# EAGLE design rp-schield-vias (EAGLE 9.0.1)
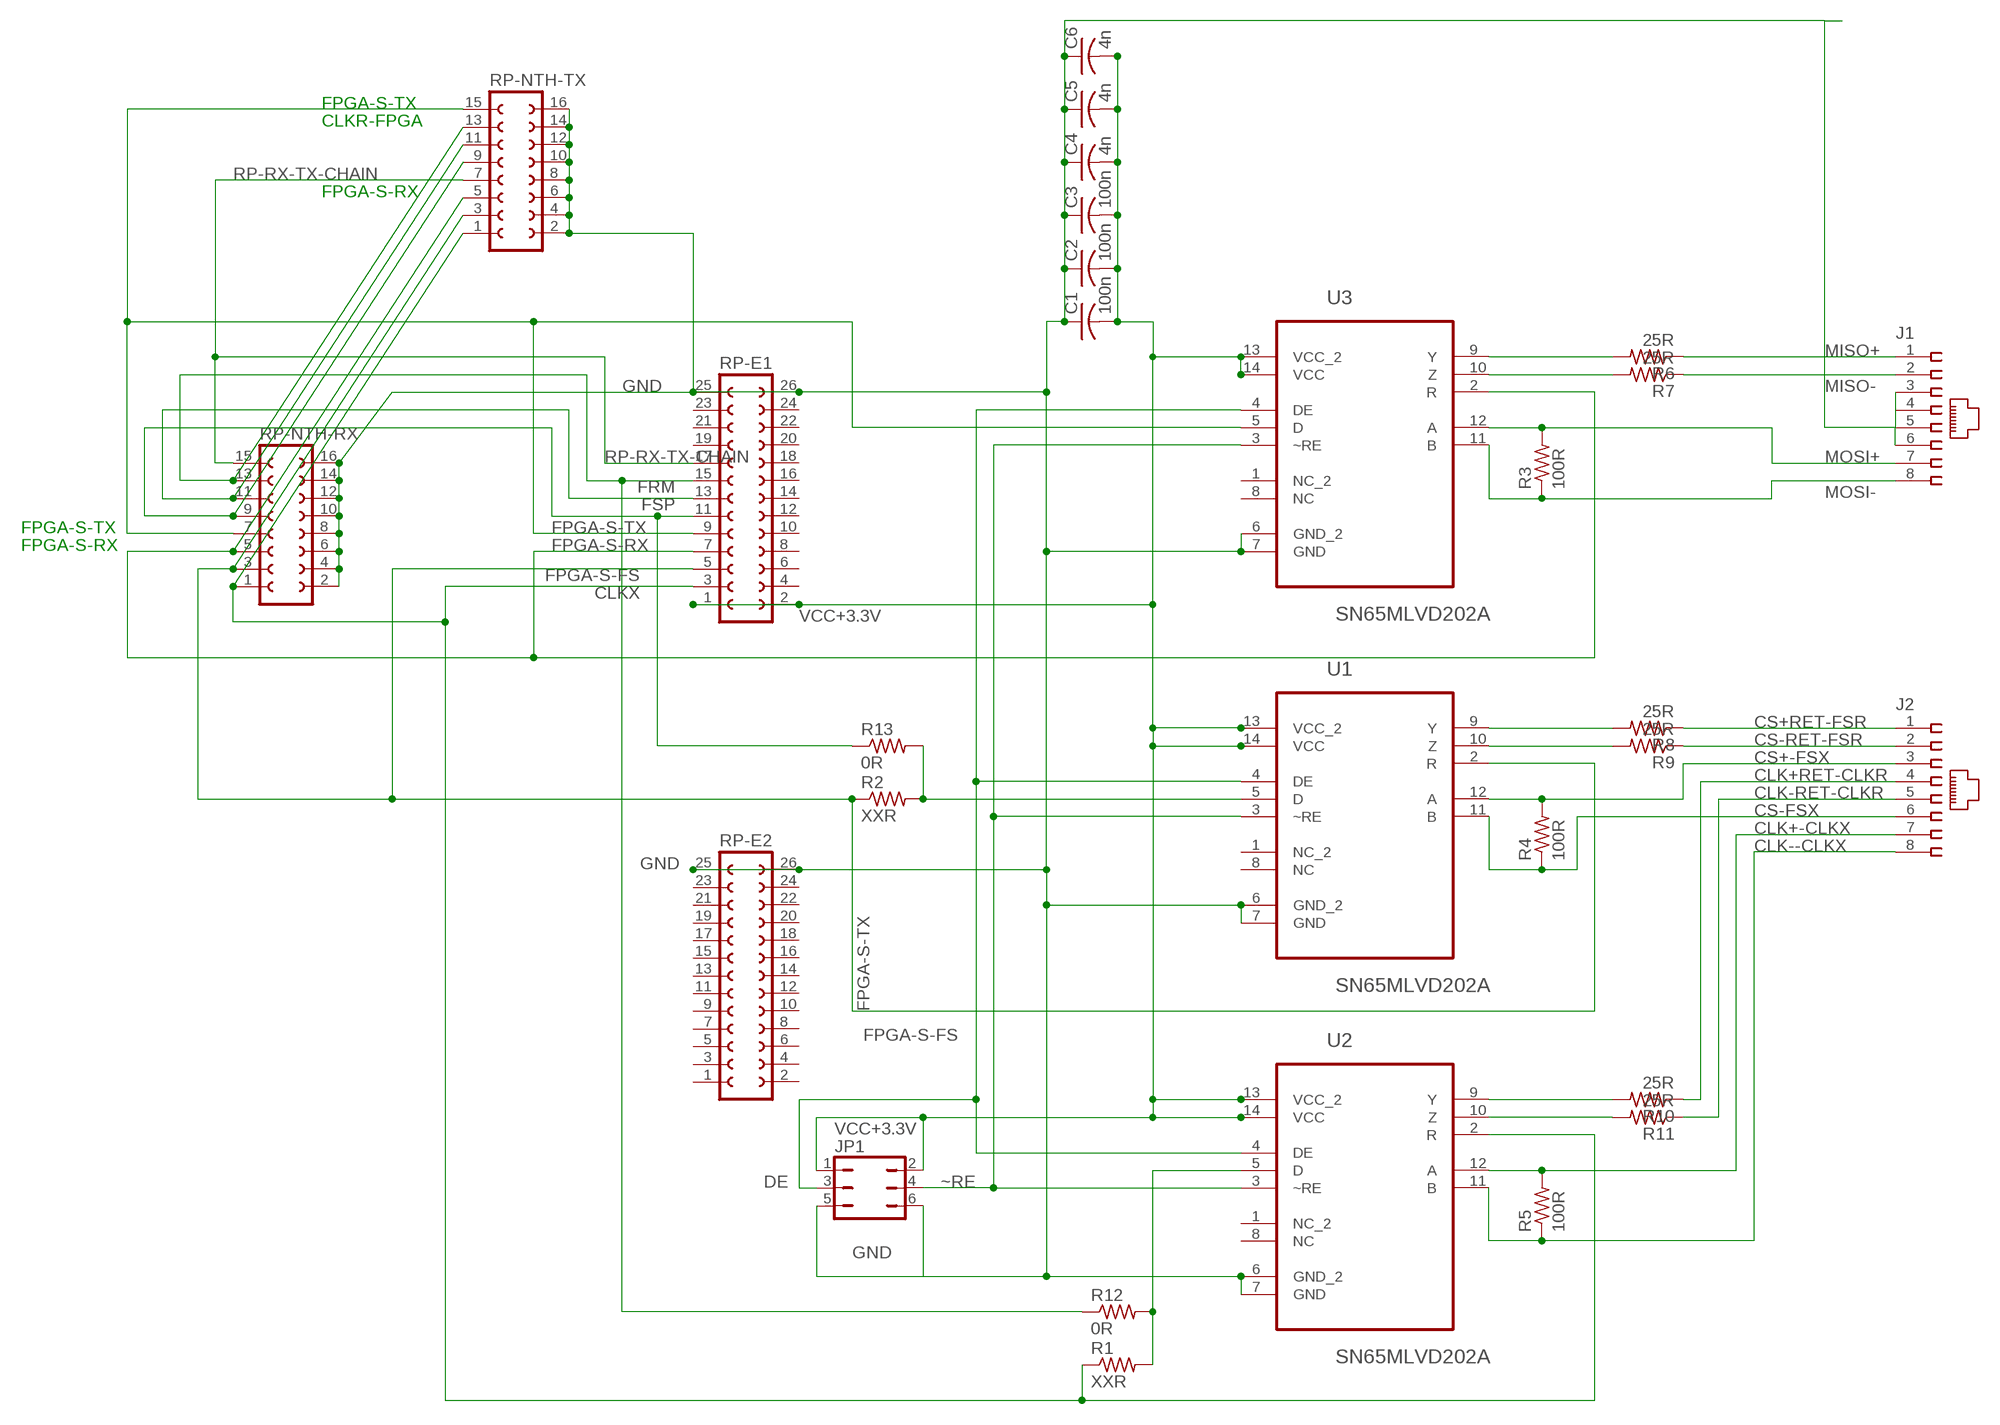
[diagram p0: schematic, sheet 1]

## Parts
C1  100n  C-USC0805  [C0805]
C2  100n  C-USC0805  [C0805]
C3  100n  C-USC0805  [C0805]
C4  4n  C-USC0805  [C0805]
C5  4n  C-USC0805  [C0805]
C6  4n  C-USC0805  [C0805]
J1  557785-1-SHIELD  [557785-1]
J2  557785-1-SHIELD  [557785-1]
JP1  JP3Q  [JP3Q]
R1  XXR  R-US_M1206  [M1206]
R2  XXR  R-US_M1206  [M1206]
R3  100R  R-US_R0402  [R0402]
R4  100R  R-US_R0402  [R0402]
R5  100R  R-US_R0402  [R0402]
R6  25R  R-US_R0402  [R0402]
R7  25R  R-US_R0402  [R0402]
R8  25R  R-US_R0402  [R0402]
R9  25R  R-US_R0402  [R0402]
R10  25R  R-US_R0402  [R0402]
R11  25R  R-US_R0402  [R0402]
R12  0R  R-US_M1206  [M1206]
R13  0R  R-US_M1206  [M1206]
RP-E1  FE13-2  [FE13-2]
RP-E2  FE13-2  [FE13-2]
RP-NTH-RX  FE08-2  [FE08-2]
RP-NTH-TX  FE08-2  [FE08-2]
U1  SN65MLVD202A  SN65MLVD205AD  [SOIC127P600X175-14N]
U2  SN65MLVD202A  SN65MLVD205AD  [SOIC127P600X175-14N]
U3  SN65MLVD202A  SN65MLVD205AD  [SOIC127P600X175-14N]

## Nets
CLK+-CLKX: J2.4 R10.1
CLK+RET-CLKR: J2.7 R5.2 U2.12(A)
CLK--CLKX: J2.5 R11.1
CLK-RET-CLKR: J2.8 R5.1 U2.11(B)
CLKX: R1.1 RP-E1.3 RP-NTH-RX.1 RP-NTH-TX.1 U2.2(R)
CS+-FSX: J2.3 R4.2 U1.12(A)
CS+RET-FSR: J2.1 R8.1
CS-FSX: J2.6 R4.1 U1.11(B)
CS-RET-FSR: J2.2 R9.1
DE: JP1.3 U1.4(DE) U2.4(DE) U3.4(DE)
FPGA-S-FS: R2.1 RP-E1.5 RP-NTH-RX.3 RP-NTH-TX.3 U1.2(R)
FPGA-S-RX: RP-E1.7 RP-NTH-RX.5 RP-NTH-TX.5 U3.2(R)
FPGA-S-TX: RP-E1.9 RP-NTH-RX.7 RP-NTH-TX.15 U3.5(D)
FRM: RP-E1.13 RP-NTH-RX.11 RP-NTH-TX.11
FSP: R13.1 RP-E1.11 RP-NTH-RX.9 RP-NTH-TX.9
GND: C1.1 C2.1 C3.1 C4.1 C5.1 C6.1 J1.3 J1.4 J1.5 J1.6 JP1.5 JP1.6 RP-E1.25 RP-E1.26 RP-E2.25 RP-E2.26 RP-NTH-RX.2 RP-NTH-RX.4 RP-NTH-RX.6 RP-NTH-RX.8 RP-NTH-RX.10 RP-NTH-RX.12 RP-NTH-RX.14 RP-NTH-RX.16 RP-NTH-TX.2 RP-NTH-TX.4 RP-NTH-TX.6 RP-NTH-TX.8 RP-NTH-TX.10 RP-NTH-TX.12 RP-NTH-TX.14 RP-NTH-TX.16 U1.6(GND_2) U1.7(GND) U2.6(GND_2) U2.7(GND) U3.6(GND_2) U3.7(GND)
MISO+: J1.1 R6.1
MISO-: J1.2 R7.1
MOSI+: J1.7 R3.2 U3.12(A)
MOSI-: J1.8 R3.1 U3.11(B)
N$1: R6.2 U3.9(Y)
N$2: R1.2 R12.2 U2.5(D)
N$3: R7.2 U3.10(Z)
N$4: R8.2 U1.9(Y)
N$5: R9.2 U1.10(Z)
N$6: R2.2 R13.2 U1.5(D)
N$7: R10.2 U2.9(Y)
N$8: R11.2 U2.10(Z)
N$10: R12.1 RP-E1.15 RP-NTH-RX.13 RP-NTH-TX.13
RP-RX-TX-CHAIN: RP-E1.17 RP-NTH-RX.15 RP-NTH-TX.7
VCC+3.3V: C1.2 C2.2 C3.2 C4.2 C5.2 C6.2 JP1.1 JP1.2 RP-E1.1 RP-E1.2 U1.13(VCC_2) U1.14(VCC) U2.13(VCC_2) U2.14(VCC) U3.13(VCC_2) U3.14(VCC)
~RE: JP1.4 U1.3(~RE) U2.3(~RE) U3.3(~RE)
Unconnected: RP-E1.4 RP-E1.6 RP-E1.8 RP-E1.10 RP-E1.12 RP-E1.14 RP-E1.16 RP-E1.18 RP-E1.19 RP-E1.20 RP-E1.21 RP-E1.22 RP-E1.23 RP-E1.24 RP-E2.1 RP-E2.2 RP-E2.3 RP-E2.4 RP-E2.5 RP-E2.6 RP-E2.7 RP-E2.8 RP-E2.9 RP-E2.10 RP-E2.11 RP-E2.12 RP-E2.13 RP-E2.14 RP-E2.15 RP-E2.16 RP-E2.17 RP-E2.18 RP-E2.19 RP-E2.20 RP-E2.21 RP-E2.22 RP-E2.23 RP-E2.24 U1.1(NC_2) U1.8(NC) U2.1(NC_2) U2.8(NC) U3.1(NC_2) U3.8(NC)

## Notes on the sheet
- FPGA-S-TX
- CLKR-FPGA
- FPGA-S-RX
- FPGA-S-TX
- FPGA-S-RX

## Library data of the parts
C1-C6 = resistor:C-US: CAPACITOR, American symbol
J1 J2 = con-amp-rj45-shield:557785-1-SHIELD: AMP connector
JP1 = jumper:JP3Q: JUMPER
R1-R13 = resistor:R-US_: RESISTOR, American symbol
RP-E1 RP-E2 = con-lsta:FE13-2: FEMALE HEADER; OC_FARNELL: unknown; OC_NEWARK: unknown
RP-NTH-RX RP-NTH-TX = con-lsta:FE08-2: FEMALE HEADER; OC_FARNELL: unknown; OC_NEWARK: unknown
U1-U3 = Texas Instruments_By_element14_Batch_1:SN65MLVD205AD: MULTIPOINT-LVDS LINE DRIVER AND RECEIVER; MPN: SN65MLVD205AD; OC_FARNELL: 90H3613; OC_NEWARK: -; PACKAGE: SOIC-14; SUPPLIER: TEXAS INSTRUMENTS

## Board
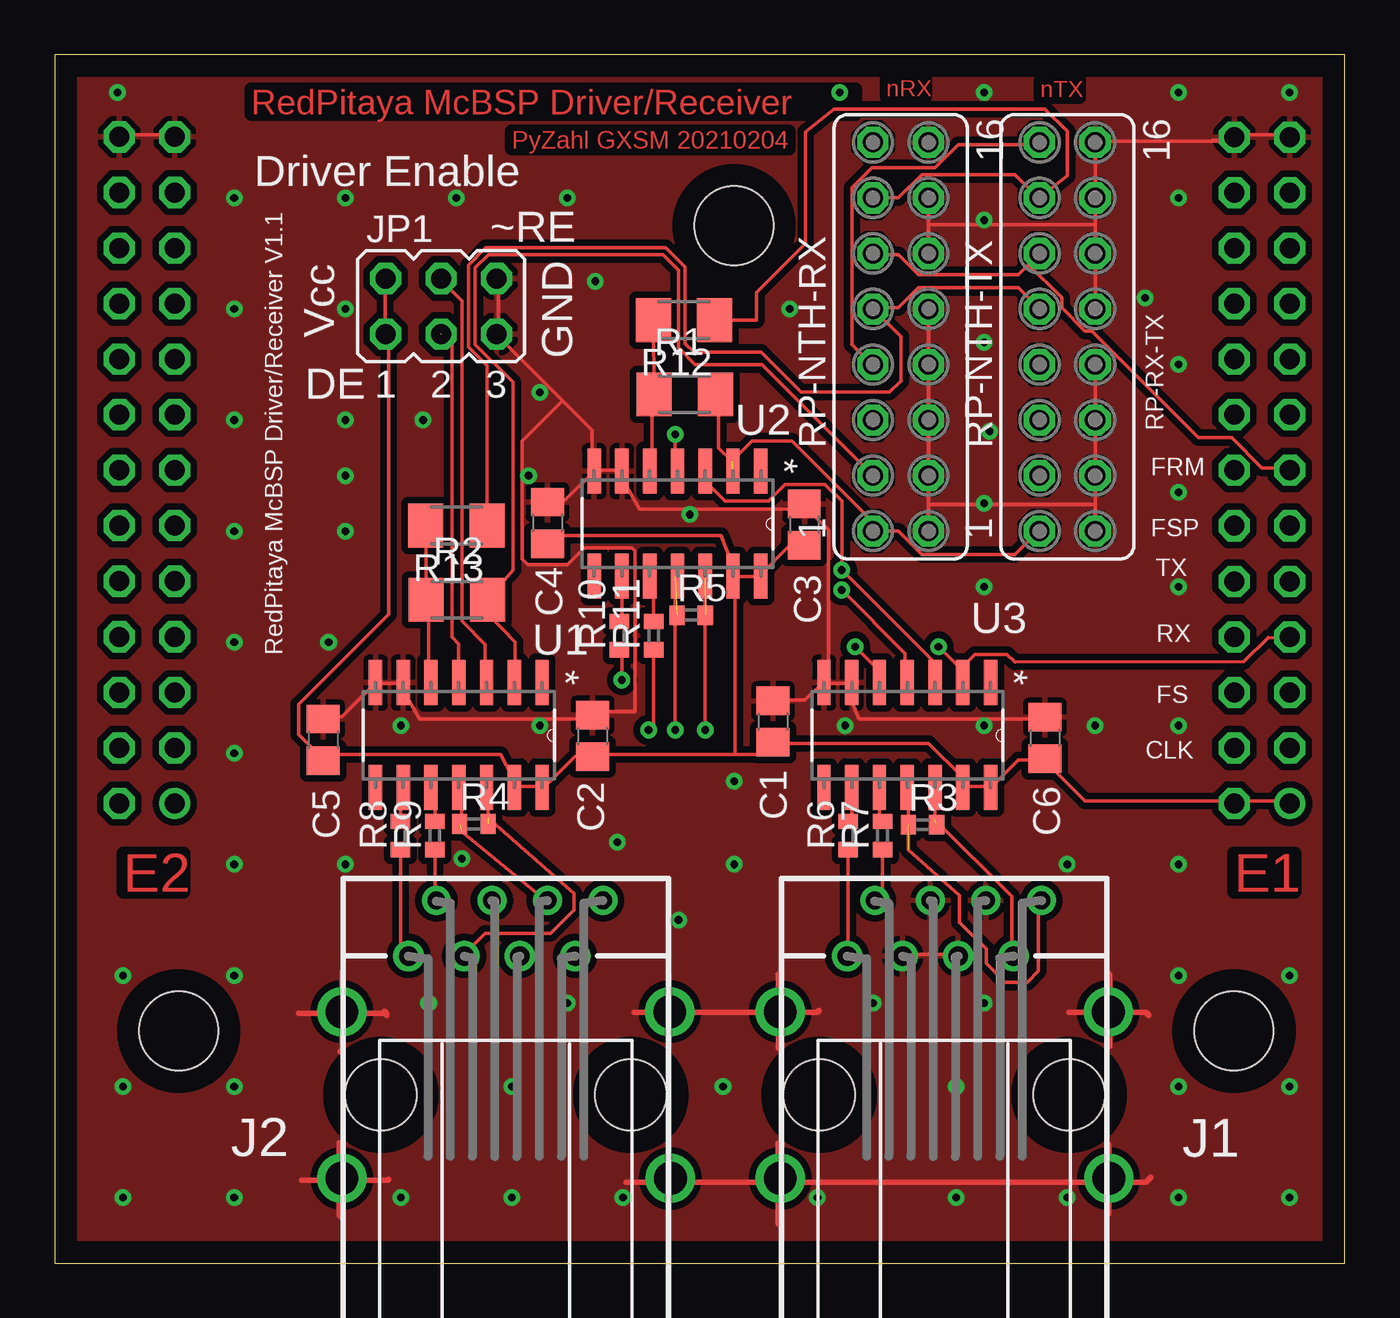
[diagram p1: board, top side]
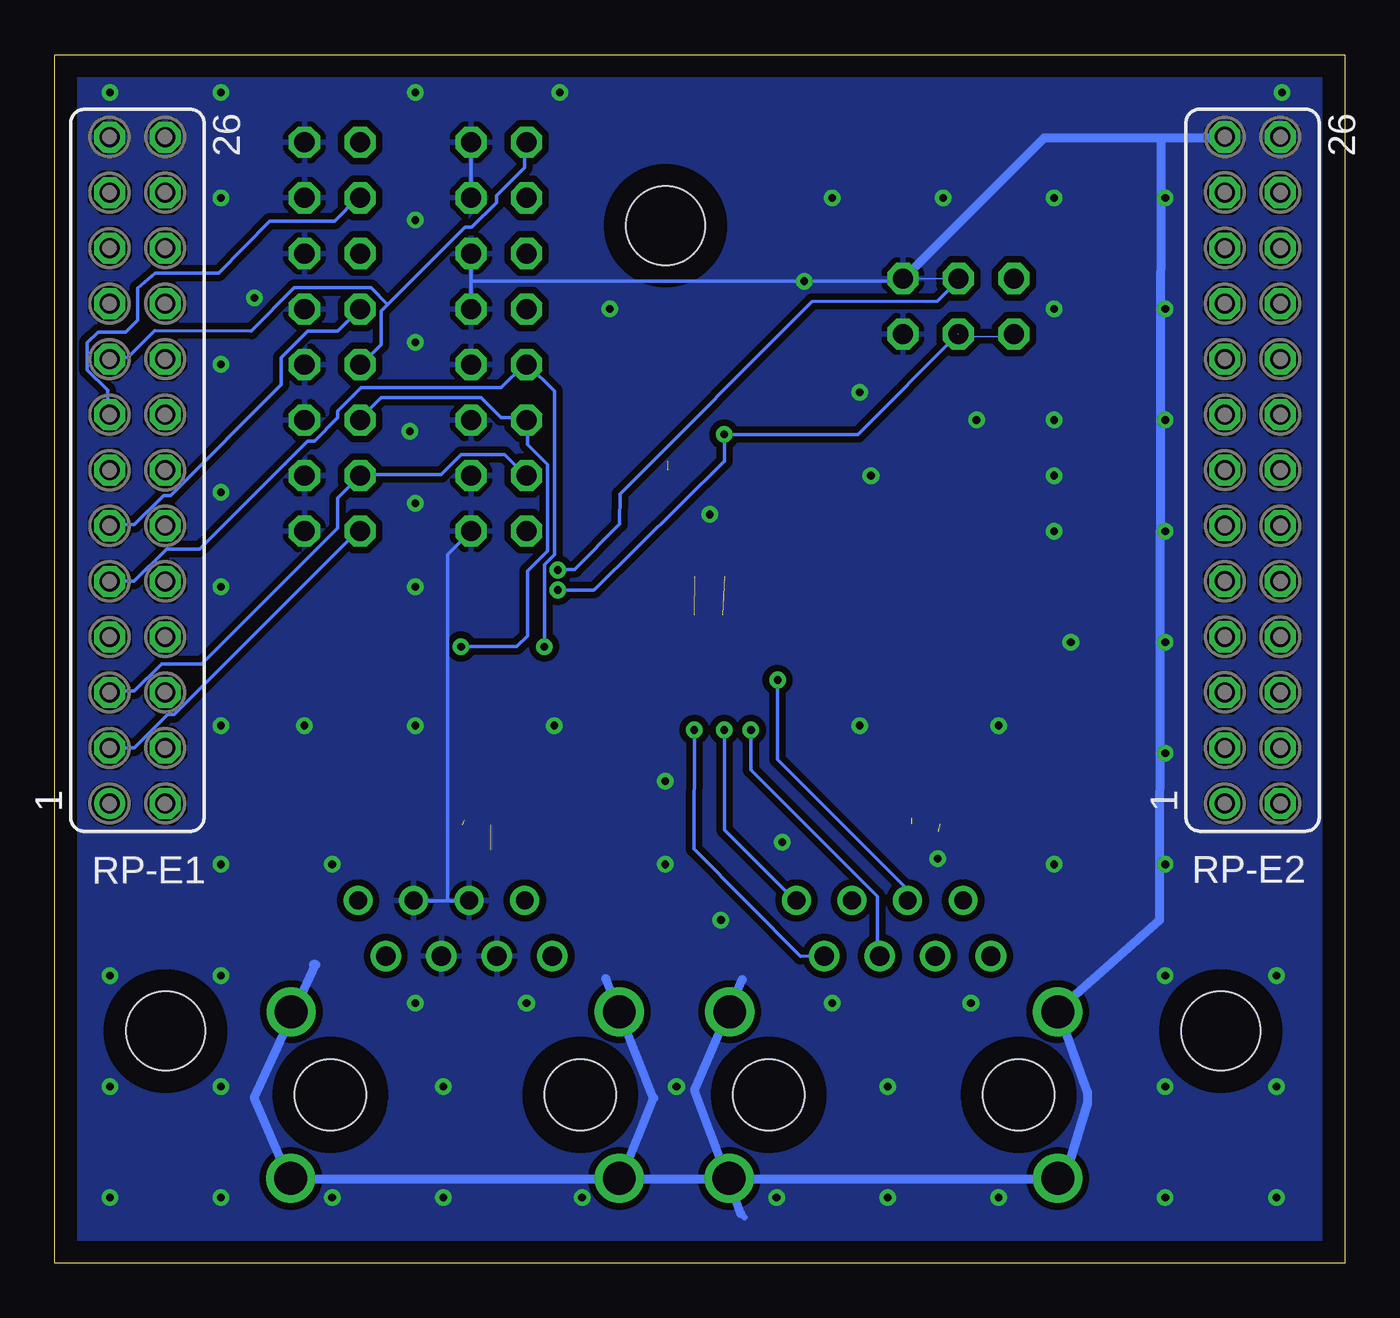
[diagram p2: board, bottom side, seen from below]

Size 59 x 55.27 mm. Coordinates in mm from the lower left corner, seen from the top.
Outline: 0,0 59,0 59,55.27 0,55.27 0,0
Copper layers (1*16): Top 0.035mm / dielectric 1.5mm / Bottom 0.035mm
Design rules "default": minimum track width 6mil, minimum drill 0.35mm, track to track 6mil, track to pad 6mil, pad to pad 6mil, via to via 6mil, smd to smd 6mil, copper to edge 40mil, drill to drill 6mil, minimum pad ring 10mil, minimum via ring 8mil, stop-mask expansion 4mil, vias tented up to drill 0mil, thermal gap 10mil
Holes 3.6 mm at 5.67,10.62 53.93,10.62 31.07,47.45

### Footprints (pad centres in the part's own frame; a part is rotated, then mirrored left to right if it is on the bottom)
C0805 = smd 1.3 x 1.5: 1 -0.95,0; 2 0.95,0
557785-1 = drill 0.889: 1 -4.445,6.35; 3 -1.905,6.35; 5 0.635,6.35; 7 3.175,6.35 | drill 0.813: 2 -3.175,8.89; 4 -0.635,8.89; 6 1.905,8.89; 8 4.445,8.89 | drill 1.5: P$1 -7.5,3.8; P$2 7.5,3.8; P$3 -7.5,-3.82; P$4 7.526,-3.821 | hole 3.251: -5.715,0; 5.715,0
JP3Q = drill 0.914 octagon: 1 -2.54,-1.27; 2 -2.54,1.27; 3 0,-1.27; 4 0,1.27; 5 2.54,-1.27; 6 2.54,1.27
M1206 = smd 1.6 x 2: 1 -1.4,0; 2 1.4,0
R0402 = smd 0.7 x 0.9: 1 -0.65,0; 2 0.65,0
FE13-2 = drill 0.914: 1 -15.24,1.27 | drill 0.914 octagon: 2 -15.24,-1.27; 3 -12.7,1.27; 4 -12.7,-1.27; 5 -10.16,1.27; 6 -10.16,-1.27; 7 -7.62,1.27; 8 -7.62,-1.27; 9 -5.08,1.27; 10 -5.08,-1.27; 11 -2.54,1.27; 12 -2.54,-1.27; 13 0,1.27; 14 0,-1.27; 15 2.54,1.27; 16 2.54,-1.27; 17 5.08,1.27; 18 5.08,-1.27; 19 7.62,1.27; 20 7.62,-1.27; 21 10.16,1.27; 22 10.16,-1.27; 23 12.7,1.27; 24 12.7,-1.27; 25 15.24,1.27; 26 15.24,-1.27
FE08-2 = drill 0.914 octagon: 1 -8.89,1.27; 2 -8.89,-1.27; 3 -6.35,1.27; 4 -6.35,-1.27; 5 -3.81,1.27; 6 -3.81,-1.27; 7 -1.27,1.27; 8 -1.27,-1.27; 9 1.27,1.27; 10 1.27,-1.27; 11 3.81,1.27; 12 3.81,-1.27; 13 6.35,1.27; 14 6.35,-1.27; 15 8.89,1.27; 16 8.89,-1.27
SOIC127P600X175-14N = smd 2.057 x 0.61: 1 -4.801,7.62; 2 -4.801,6.35; 3 -4.801,5.08; 4 -4.801,3.81; 5 -4.801,2.54; 6 -4.801,1.27; 7 -4.801,0; 8 0,0; 9 0,1.27; 10 0,2.54; 11 0,3.81; 12 0,5.08; 13 0,6.35; 14 0,7.62

### Placement (x,y rotation side)
C1  32.85,24.77 270 top
C2  24.6,24.12 270 top
C3  34.28,33.78 270 top
C4  22.53,33.86 270 top
C5  12.28,23.94 270 top
C6  45.28,24.02 270 top
J1  40.68,7.7 0 top
J2  20.63,7.7 0 top
JP1  17.68,43.77 0 top
R1  28.81,39.74 180 top
R2  18.4,30.34 180 top
R3  39.69,20.05 0 top
R4  19.17,20.09 0 top
R5  29.11,29.64 0 top
R6  36.28,19.56 90 top
R7  37.86,19.56 90 top
R8  15.81,19.56 90 top
R9  17.39,19.56 90 top
R10  25.82,28.7 90 top
R11  27.39,28.7 90 top
R12  28.78,43.13 180 top
R13  18.37,33.73 180 top
RP-E1  55.22,36.26 90 bottom
RP-E2  4.22,36.27 90 bottom
RP-NTH-RX  38.69,42.37 90 top
RP-NTH-TX  46.31,42.37 90 top
U1  14.67,21.75 270 top
U2  24.67,31.42 270 top
U3  35.18,21.75 270 top

### Tracks (layer width: path | path; a pad name or v marks a point on that pad's centre or on a via)
CLK+-CLKX  (via drill 0.35)
  Top 0.152: R10.1 25.94,27.93 v25.94,26.67
  Bottom 0.152: v25.94,26.67 25.94,23.03 20,17.09 J2.4
CLK+RET-CLKR  (via drill 0.35)  (1 unrouted)
  Top 0.152: v29.75,24.39 29.75,31.4 U2.12
  Bottom 0.152: v29.75,24.39 29.77,18.96 24.9,14.02 J2.7
CLK--CLKX  (via drill 0.35)
  Top 0.152: R11.1 27.39,24.62 v27.16,24.39
  Bottom 0.152: v27.16,24.39 27.16,22.56 21.37,16.77 21.37,14.18 J2.5
CLK-RET-CLKR  (via drill 0.35)  (1 unrouted)
  Top 0.152: v28.38,24.39 28.38,31.4 U2.11
  Bottom 0.152: v28.38,24.39 28.38,19.81 25.18,16.61 J2.8
CLKX  (1 unrouted)
  Top 0.152: 30.97,36.73 30.97,36.68 | 30.97,36.27 U2.2 | 30.97,36.68 30.36,37.29 30.36,40.49 R1.1 | RP-NTH-TX.1 44.99,33.48 43.92,32.41 39.65,32.41 38.59,33.48 RP-NTH-RX.1 37.37,33.48 37.37,33.94 33.71,37.6 31.88,37.6 30.97,36.68
  Bottom 0.152: RP-E1.3 56.42,23.57 55.35,23.57 53.83,25.1 53.52,25.1 45.14,33.48 RP-NTH-TX.1
CS+-FSX  (1 unrouted)
  Top 0.152: U1.12 19.84,21.64 19.83,20.37 23.75,16.92 23.75,16.16 22.69,15.09 19.69,15.09 18.78,14.18 J2.3
CS+RET-FSR
  Top 0.152: 16.03,14.18 J2.1 15.81,14.42 R8.1
CS-FSX  (1 unrouted)
  Top 0.152: U1.11 18.62,21.64 18.62,19.74 22.43,16.61 J2.6
CS-RET-FSR
  Top 0.152: 17.25,16.77 17.41,16.61 J2.2 17.39,16.66 R9.1
DE  (via drill 0.35)  (1 unrouted)
  Top 0.152: 28.38,36.68 28.38,36.27 U2.4 28.38,36.68 | v36,30.79 38.89,27.89 38.89,26.67 U3.4 | v28.38,37.9 28.38,36.68 | U1.4 18.47,26.62 18.47,28.33 18.17,28.63 18.17,42.01 17.71,42.47 JP1.3
  Bottom 0.152: v36,30.79 34.33,30.79 28.38,36.68 v28.38,37.9 22.28,37.9 JP1.3
FPGA-S-FS
  Top 0.152: U1.2 21.06,26.67 21.06,27.13 21.07,28.42 19.84,29.67 19.84,30.28 R2.1 20.96,31.7 20.96,40.29 19.23,42.01 19.23,45.52 19.84,46.13 27.82,46.13 28.53,45.42 28.53,41.86 29.29,41.1 32.34,41.1 RP-NTH-RX.3
  Bottom 0.152: RP-NTH-RX.3 37.52,36.07 38.44,36.98 40.42,36.98 41.33,36.07 44.99,36.07 RP-NTH-TX.3 46.06,35 46.06,33.63 52.27,27.4 54.1,27.4 55.35,26.16 56.42,26.16 RP-E1.5
FPGA-S-RX  (via drill 0.35)  (1 unrouted)
  Top 0.152: v40.42,28.2 41.48,27.13 41.48,26.67 U3.2 41.48,27.23 42.09,27.84 43.55,27.84 43.91,27.49 54.39,27.53 55.5,28.62 56.42,28.6 RP-E1.7
  Bottom 0.152: v40.42,28.2 37.88,28.2 | RP-NTH-TX.5 44.99,38.66 44.07,39.58 39.5,39.58 38.59,38.66 37.52,38.66 RP-NTH-RX.5 37.37,38.51 37.37,37.44 36.45,36.53 36.45,32.57 37.37,31.65 37.37,28.68 37.88,28.2
FPGA-S-TX  (via drill 0.35)
  Top 0.152: v36.61,28.2 37.67,27.13 37.67,26.67 U3.5 | RP-NTH-TX.15 44.99,51.16 41.33,51.16 40.27,50.09 37.37,50.09 36.45,49.18 36.45,42.01 37.37,41.1 RP-NTH-RX.7
  Bottom 0.152: v36.61,28.2 36.61,31.96 36.15,32.41 36.15,39.88 37.37,41.1 RP-NTH-RX.7 37.52,41.1 38.59,40.03 44.99,40.03 46.06,38.97 46.06,38.66 47.12,37.6 47.43,37.6 52.36,32.66 53.88,32.66 55.35,31.19 56.42,31.19 RP-E1.9
FRM
  Top 0.152: RP-NTH-TX.11 44.53,45.67 | 44.53,45.67 44.07,45.22 39.5,45.22 38.59,46.13 37.52,46.13 RP-NTH-RX.11 | 44.53,45.67 46.06,44.15 46.06,43.69 47.12,42.62 47.43,42.62 52.3,37.75 53.83,37.75 55.2,36.38 56.42,36.38 RP-E1.13
FSP
  Top 0.152: RP-NTH-TX.9 44.07,44.61 39.5,44.61 38.59,43.69 37.52,43.69 RP-NTH-RX.9 38.69,42.37 38.69,40.34 38.18,39.83 34.12,39.83 32.29,41.66 29.24,41.66 28.84,42.07 28.84,43.64 28.84,43.77 28.84,45.54 27.95,46.43 19.72,46.43 18.93,45.65 18.93,41.89 19.77,41.05 R13.1
  Bottom 0.152: RP-NTH-TX.9 46.06,42.62 47.43,42.62 48.65,41.41 48.65,40.19 53.7,35.1 54.01,35.1 55.35,33.79 56.42,33.79 RP-E1.11
GND  (via drill 0.35)
  Top 0.076: JP1.6 20.15,45.06
  Top 0.152: C5.1 12.38,25 13.14,25 14.66,26.52 U1.7 | U1.7 14.81,26.52 15.88,26.52 U1.6 16.03,26.52 16.03,26.06 16.69,24.89 24.72,24.89 C2.1 24.72,24.95 25,25.22 26.55,25.22 26.55,32.57 26.4,32.72 24.21,32.72 23.45,31.96 21.62,31.96 21.37,32.21 21.37,37.6 23.22,39.45 | C4.1 22.28,34.9 23.35,34.9 24.57,36.12 U2.7 | U2.7 24.72,36.27 25.94,36.27 U2.6 26.09,36.12 26.09,35.66 26.75,34.5 33.91,34.5 C3.1 34.32,34.6 35.39,33.53 35.39,26.82 35.24,26.67 U3.7 | JP1.6 20.3,44.96 20.3,42.52 JP1.5 20.3,42.37 23.22,39.45 | 23.22,39.45 24.57,38.1 24.57,36.27 U2.7 | 14.66,26.67 U1.7 | C6.1 45.23,24.9 36.78,24.9 36.45,25.67 36.45,26.52 U3.6 36.3,26.52 35.24,26.52 U3.7 | C1.1 32.95,25.76 34.32,25.76 35.08,26.52 U3.7 | 53.83,51.36 52.96,51.36 53.22,51.31 47.58,51.31 RP-NTH-TX.16 RP-NTH-TX.14 47.58,47.5 | 53.98,51.62 53.98,51.51 53.83,51.46 53.83,51.36 | 53.98,51.62 RP-E1.26 | 56.42,51.62 RP-E1.25 | 56.42,51.62 53.98,51.62 | 53.98,51.62 53.83,51.36 | 56.42,51.62 56.42,51.51 | RP-NTH-TX.10 RP-NTH-TX.12 47.58,47.5 | 47.58,34.7 RP-NTH-TX.4 RP-NTH-TX.6 RP-NTH-TX.8 | 47.58,34.7 RP-NTH-TX.2 | 39.96,34.7 RP-NTH-RX.4 RP-NTH-RX.6 RP-NTH-RX.8 RP-NTH-RX.10 | 39.96,34.7 RP-NTH-RX.2 | RP-NTH-RX.12 39.96,47.5 | 39.96,47.5 RP-NTH-RX.14 | 39.96,34.7 47.58,34.7 | 39.96,47.5 47.58,47.5 | RP-E2.26 3.08,51.62 5.37,51.62 RP-E2.25 | 40.11,14.12 41.18,14.12 J1.5 | 40.11,14.12 38.89,14.12 J1.3 | 40.11,14.12 40.11,16.56 J1.4
  Top 0.254: 11.16,11.43 15,11.43 15.1,11.53 15.19,11.43 15.19,11.34 | 13.15,13.33 13.15,9.76 13.06,9.67 | 13.02,5.51 13.02,2.21 13.15,2.07 | 11.3,3.79 15.23,3.79 15.28,3.84 | 26.13,3.7 49.91,3.7 50.13,3.93 | 26.49,11.48 34.85,11.48 34.94,11.57 34.94,11.53 | 28.09,13.18 28.09,9.91 28.05,9.88 | 33.07,13.21 33.11,13.18 33.11,9.82 | 46.38,11.48 49.91,11.48 50.04,11.34 | 48.27,13.21 48.27,9.95 48.23,9.92 | 48.2,5.43 48.2,2.29 48.14,2.22 | 33.07,5.49 33.07,1.82 33.14,1.75
  Bottom 0.076: 18.25,45.04 20.26,45.03
  Bottom 0.152: RP-NTH-RX.12 39.96,44.91 | 39.96,44.91 RP-NTH-RX.10 | RP-NTH-RX.14 RP-NTH-RX.16 | 5.52,51.46 RP-E2.25 | 20.15,45.06 JP1.6 20.3,44.91 39.96,44.91 | 41.03,16.56 42.55,16.56 J1.6 | 41.03,16.56 40.11,16.56 J1.4 | 41.03,16.56 41.03,32.41 RP-NTH-RX.2
  Bottom 0.254: 8.4,51.37 5.42,51.51
  Bottom 0.305: 12.78,4.02 13.35,3.83 | 48.15,3.83 48.34,4.02 | 27.45,2.1 27.62,2.27
  Bottom 0.406: 5.52,51.46 13.75,51.46 20.15,45.06 | 12.78,4.02 11.77,7.32 11.77,7.83 13.13,11.55 8.46,15.7 8.4,51.37 | 13.35,3.83 33.09,3.83 | 33.09,3.83 48.15,3.83 | 33.09,3.83 31.61,7.55 33.79,13.02 | 48.34,4.02 49.87,7.57 47.06,13.66 47.18,13.66 | 27.62,2.27 29.73,7.9 27.56,12.96
  other vias: 3.13,3 3.13,8.08 3.13,13.16 8.21,3 8.21,8.08 8.21,13.16 15.83,3 20.91,3 25.99,3 34.88,3 41.23,3 46.31,3 56.47,3 56.47,8.08 56.47,13.16 51.39,13.16 51.39,8.08 51.39,3 41.23,8.08 20.91,8.08 17.1,11.89 23.45,11.89 37.42,11.89 42.5,11.89 51.39,18.24 8.21,18.24 8.21,23.32 8.21,28.4 8.21,33.48 8.21,38.56 8.21,43.64 8.21,48.72 13.29,48.72 18.37,48.72 23.45,48.72 51.39,48.72 46.31,18.24 13.29,18.24 31.07,18.24 31.07,22.05 28.53,15.7 13.29,43.64 13.29,38.56 13.29,33.48 15.83,24.59 22.18,24.59 36.15,24.59 42.5,24.59 21.67,36.02 22.18,39.83 24.72,44.91 51.39,30.94 42.5,30.94 51.39,24.59 33.61,43.64 51.39,41.1 13.29,36.02 16.85,38.56 25.74,19.26 18.62,18.49 29.04,34.24 47.58,24.59 51.39,35.26 42.5,47.7 42.5,42.12 42.75,38.05 42.5,34.75 49.87,44.15 35.9,53.55 42.5,53.55 51.39,53.55 12.53,28.4 30.56,8.08 2.88,53.55 56.47,53.55
  pour Top (isolate 0.305): 59.01,-0.05 59.01,55.32 -0.17,55.32 -0.17,-0.05
  pour Bottom (isolate 0.305): 59.01,-0.05 59.01,55.32 -0.17,55.32 -0.17,-0.05
MISO+
  Top 0.152: J1.1 36.3,14.18 36.28,14.19 R6.1
MISO-
  Top 0.152: 37.67,16.77 37.52,16.61 J1.2 37.86,16.94 R7.1
MOSI+  (1 unrouted)
  Top 0.152: U3.12 40.27,21.64 40.27,20.27 43.77,16.77 43.77,14.18 J1.7
MOSI-  (1 unrouted)
  Top 0.152: U3.11 39.05,21.64 39.05,18.9 41.38,16.82 41.38,15.6 42.6,14.38 42.6,13.72 43.46,12.86 44.48,12.86 44.99,13.36 44.99,16.46 J1.8
N$1
  Top 0.152: U3.9 36.45,20.37 R6.2
N$2
  Top 0.152: 27.16,36.68 27.16,36.27 U2.5 27.16,36.68 | 27.16,36.68 27.31,36.83 27.31,40.49 R1.2 R12.2
N$3
  Top 0.152: U3.10 37.72,20.35 R7.2
N$4
  Top 0.152: R8.2 15.81,21.62 U1.9
N$5
  Top 0.152: U1.10 17.39,21.57 R9.2
N$6
  Top 0.152: U1.5 17.1,26.62 17.1,30.28 R2.2 17,33.71 arc90 R13.2
N$7
  Top 0.152: U2.9 25.94,29.47 R10.2
N$8
  Top 0.152: U2.10 27.39,31.24 R11.2
N$10
  Top 0.152: RP-NTH-RX.13 38.59,48.72 39.65,49.79 43.92,49.79 44.99,48.72 RP-NTH-TX.13 46.31,49.74 46.31,51.77 45.29,52.78 35.64,52.78 34.37,51.77 34.34,51.73 34.34,46.63 32.09,44.38 32.09,43.13 R12.1
  Bottom 0.152: RP-E1.15 56.57,38.81 56.58,39.92 57.52,40.85 57.52,42.1 57,42.58 55.76,42.58 55.19,43.14 55.19,44.6 54.41,45.28 51.5,45.28 49.17,47.65 46.21,47.65 45.14,48.72 RP-NTH-TX.13
RP-RX-TX-CHAIN
  Bottom 0.152: 43.77,43.84 44.07,43.54 44.07,42.01 44.99,41.1 RP-NTH-TX.7 | 43.77,43.84 40.24,47.37 39.94,47.37 38.8,48.51 38.8,48.82 37.52,50.09 37.52,51.16 RP-NTH-RX.15 | 43.77,43.84 44.53,44.61 48.04,44.61 50.02,42.62 54.43,42.64 55.65,41.42 56.42,41.41 RP-E1.17
VCC
  Bottom 0.076: 15.58,42.37 17.1,42.37
VCC+3.3V
  Top 0.152: JP1.2 15.12,44.96 15.12,42.52 JP1.1 15.27,42.32 15.27,29.67 11.16,25.55 11.16,24.18 12.22,23.12 C5.2 12.63,23.27 20.4,23.27 20.91,22.25 20.91,21.8 U1.13 21.06,21.8 22.28,21.8 U1.14 22.43,21.8 23.81,23.17 24.72,23.17 C2.2 24.87,23.32 25.33,23.27 31.12,23.27 | C3.2 34.17,32.77 33.56,32.77 32.34,31.55 U2.14 32.19,31.4 31.12,31.4 | C4.2 22.54,33.28 30.46,33.28 30.97,32.01 30.97,31.55 U2.13 31.12,31.4 | 31.12,23.27 32.8,23.27 C1.2 32.95,23.78 39.96,23.78 41.48,22.25 41.48,21.8 U3.13 41.64,21.8 42.7,21.8 U3.14 42.86,21.8 44.07,23.02 45.14,23.02 C6.2 45.28,22.98 47.12,21.14 53.32,21.14 | 31.12,23.27 31.12,31.4 | 53.32,21.14 53.83,21.03 53.98,21.14 | 53.32,21.14 RP-E1.2 | RP-E1.1 56.42,21.14 53.98,21.14 | 53.98,21.14 53.98,21.03 53.32,21.14
~RE  (via drill 0.35)  (1 unrouted)
  Top 0.152: 29.75,36.27 U2.3 29.9,36.07 29.9,35.61 30.66,34.85 32.64,34.85 33.41,35.61 35.24,35.61 36,34.85 v36,31.7 40.11,27.59 40.11,26.67 U3.3 | U1.3 19.69,26.62 19.69,28.3 18.62,29.36 18.62,44 17.71,44.91 JP1.4
  Bottom 0.152: v36,31.7 35.97,31.73 35.23,31.73 33.16,33.8 33.15,35.17 24.37,43.97 18.62,44 17.71,44.91

### Text on the board
Top: nRX | nTX | RedPitaya McBSP Driver/Receiver | PyZahl GXSM 20210204 | E2 | E1
tPlace: Driver Enable
tNames: ~RE | Vcc | DE | GND | RP-RX-TX | FRM | FSP | TX | RX | RedPitaya McBSP Driver/Receiver V1.1 | FS | CLK
205bmp: /home/pzahl/BNLBox/RedPitayaPAC/Extension_connector.bmp